# EAGLE schematic ts808_redraw (EAGLE 9.6.0)
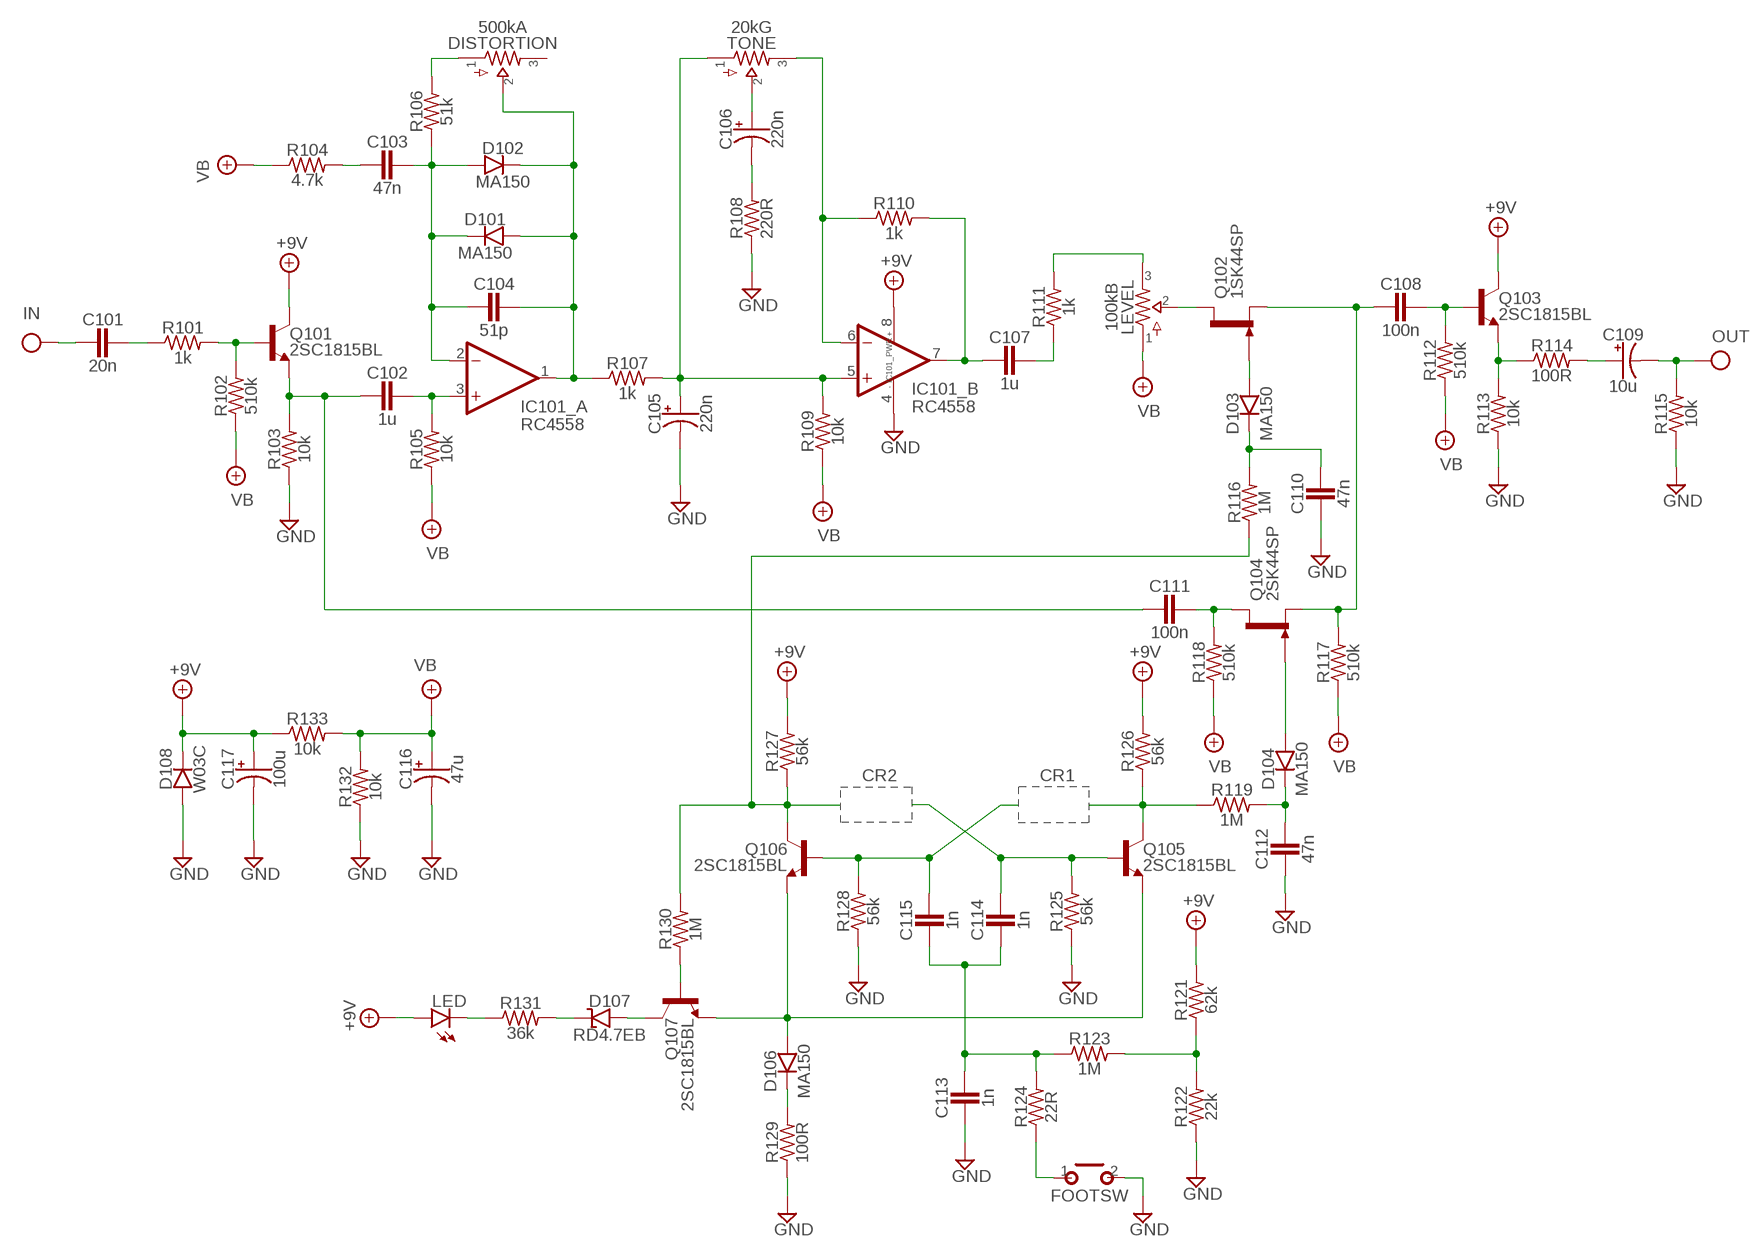
[diagram p0: schematic, sheet 1]

## Parts
C101  20n  CER/FILMBOX.1  [BOX_SMALL]
C102  1u  CER/FILMBOX.1  [BOX_SMALL]
C103  47n  CER/FILMBOX.1  [BOX_SMALL]
C104  51p  CER/FILMBOX.1  [BOX_SMALL]
C105  220n  0500  [050_020]
C106  220n  0500  [050_020]
C107  1u  CER/FILMBOX.1  [BOX_SMALL]
C108  100n  CER/FILMBOX.1  [BOX_SMALL]
C109  10u  0500  [050_020]
C110  47n  CER/FILMBOX.1  [BOX_SMALL]
C111  100n  CER/FILMBOX.1  [BOX_SMALL]
C112  47n  CER/FILMBOX.1  [BOX_SMALL]
C113  1n  CER/FILMBOX.1  [BOX_SMALL]
C114  1n  CER/FILMBOX.1  [BOX_SMALL]
C115  1n  CER/FILMBOX.1  [BOX_SMALL]
C116  47u  0500  [050_020]
C117  100u  0500  [050_020]
D101  MA150  DO35.2  [DO35-2]
D102  MA150  DO35.2  [DO35-2]
D103  MA150  DO35.2  [DO35-2]
D104  MA150  DO35.2  [DO35-2]
D106  MA150  DO35.2  [DO35-2]
D107  RD4.7EB  ZENER.2  [DO41-2]
D108  W03C  DO35.2  [DO35-2]
DISTORTION  500kA  POTS16MM  [16MM]
FOOTSW  MOMENTARY  [SPST]
IC101  RC4558  DUALTH  [DIL0]
LED  LED  [3MM_D]
LEVEL  100kB  POTS16MM  [16MM]
Q101  2SC1815BL  2N3904  [TO92-]
Q102  1SK44SP  2N5457  [TO92-]
Q103  2SC1815BL  2N3904  [TO92-]
Q104  2SK44SP  2N5457  [TO92-]
Q105  2SC1815BL  2SC828A  [TO92-]
Q106  2SC1815BL  2SC828A  [TO92-]
Q107  2SC1815BL  2SC828A  [TO92-]
R101  1k  R_.3B  [R0207/3]
R102  510k  R_.3B  [R0207/3]
R103  10k  R_.3B  [R0207/3]
R104  4.7k  R_.3B  [R0207/3]
R105  10k  R_.3B  [R0207/3]
R106  51k  R_.3B  [R0207/3]
R107  1k  R_.3B  [R0207/3]
R108  220R  R_.3B  [R0207/3]
R109  10k  R_.3B  [R0207/3]
R110  1k  R_.3B  [R0207/3]
R111  1k  R_.3B  [R0207/3]
R112  510k  R_.3B  [R0207/3]
R113  10k  R_.3B  [R0207/3]
R114  100R  R_.3B  [R0207/3]
R115  10k  R_.3B  [R0207/3]
R116  1M  R_.3B  [R0207/3]
R117  510k  R_.3B  [R0207/3]
R118  510k  R_.3B  [R0207/3]
R119  1M  R_.3B  [R0207/3]
R121  62k  R_.3B  [R0207/3]
R122  22k  R_.3B  [R0207/3]
R123  1M  R_.3B  [R0207/3]
R124  22R  R_.3B  [R0207/3]
R125  56k  R_.3B  [R0207/3]
R126  56k  R_.3B  [R0207/3]
R127  56k  R_.3B  [R0207/3]
R128  56k  R_.3B  [R0207/3]
R129  100R  R_.3B  [R0207/3]
R130  1M  R_.3B  [R0207/3]
R131  36k  R_.3B  [R0207/3]
R132  10k  R_.3B  [R0207/3]
R133  10k  R_.3B  [R0207/3]
TONE  20kG  POTS16MM  [16MM]

## Nets
+9V: C117.+ D108.C IC101.8(_PWR:V+) LED.ANODE(A) Q101.1(C) Q103.1(C) R121.2 R126.2 R127.2 R133.1
GND: C105.- C110.2 C112.2 C113.2 C116.- C117.- D108.A FOOTSW.2(S) IC101.4(_PWR:V-) R103.1 R108.1 R113.1 R115.1 R122.1 R125.1 R128.1 R129.1 R132.1
IN: C101.2
N$1: DISTORTION.1 R106.2
N$2: C107.1 R111.1
N$3: Q101.2(B) R101.2 R102.2
N$4: C102.2 C111.2 Q101.3(E) R103.2
N$5: C102.1 IC101.3(_A:+IN) R105.2
N$6: C103.1 C104.2 D101.C D102.A IC101.2(_A:-IN) R106.1
N$7: LEVEL.3 R111.2
N$8: C104.1 D101.A D102.C DISTORTION.2 IC101.1(_A:OUT) R107.1
N$9: C103.2 R104.2
N$10: C105.+ IC101.5(_B:+IN) R107.2 R109.2 TONE.1
N$11: IC101.6(_B:-IN) R110.1 TONE.3
N$12: C107.2 IC101.7(_B:OUT) R110.2
N$14: C106.+ TONE.2
N$15: C106.- R108.2
N$17: LEVEL.2 Q102.3(D)
N$18: C108.2 Q102.2(S) Q104.2(S) R117.2
N$19: D103.A Q102.1(G)
N$20: C110.1 D103.C R116.2
N$21: D104.A Q104.1(G)
N$22: C112.1 D104.C R119.2
N$23: C108.1 Q103.2(B) R112.2
N$24: Q103.3(E) R113.2 R114.1
N$25: C109.+ R114.2
N$27: C111.1 Q104.3(D) R118.2
N$29: Q106.2(C) R116.1 R127.1 R130.2
N$30: Q107.1(B) R130.1
N$31: Q105.2(C) R119.1 R126.1
N$32: C115.1 Q106.1(B) R128.2
N$33: C101.1 R101.1
N$34: C114.1 Q105.1(B) R125.2
N$35: D106.A Q105.3(E) Q106.3(E) Q107.3(E)
N$36: C113.1 C114.2 C115.2 R123.1 R124.2
N$37: D106.C R129.2
N$38: R121.1 R122.2 R123.2
N$39: FOOTSW.1(P) R124.1
N$40: LED.P$1(C) R131.1
N$41: D107.C R131.2
N$42: D107.A Q107.2(C)
OUT: C109.- R115.2
VB: C116.+ LEVEL.1 R102.1 R104.1 R105.1 R109.1 R112.1 R117.1 R118.1 R132.2 R133.2
Unconnected: DISTORTION.3

## Notes on the sheet
- CR2 | CR1

## Library data of the parts
C101-C104 C107 C108 C110-C115 = pedals-capacitors-film:CER/FILM: 47 - 120pF Xicon Ceramic Disc 2.5mm lead spacing
C105 C106 C109 C116 C117 = pedals-capacitors-elec:050
D101-D104 D106 D108 = pedals-diodes:DO35: DO-35 Package Diodes: 1N914
D107 = pedals-diodes:ZENER
DISTORTION LEVEL TONE = pedals-potentiometers:POTS
FOOTSW = pedals-switches:MOMENTARY
IC101 = pedals-integrated circuits:DUAL: OP AMP
LED = pedals-diodes:LED
Q101 Q103 = pedals-transistors:2N3904: NPN Transistor
Q102 Q104 = pedals-transistors:2N5457: N-CHANNEL JFET
Q105-Q107 = pedals-transistors:2SC828A
R101-R119 R121-R133 = pedals-resistors:R_